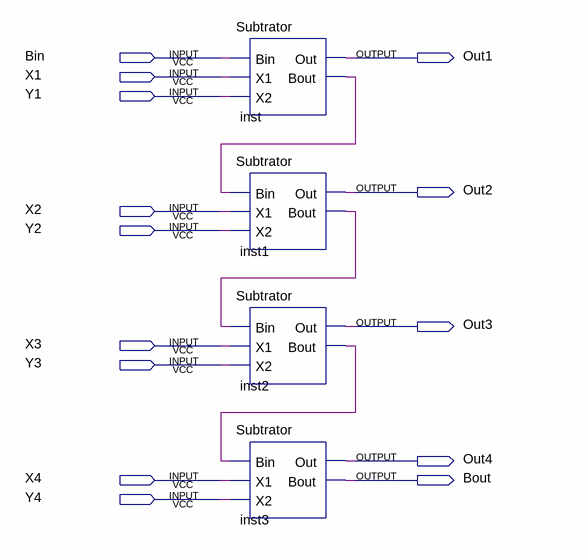
[diagram p0: schematic sheet]
// Quartus schematic subtrator4bits.bdf as structural Verilog: 4 symbols, 14 pins
module subtrator4bits (
  input  Bin,
  input  X1,
  input  Y1,
  input  X2,
  input  Y2,
  input  X3,
  input  Y3,
  input  X4,
  input  Y4,
  output Out1,
  output Out2,
  output Out3,
  output Out4,
  output Bout
);

  wire inst1_bout, inst2_bout, inst_bout;

  Subtrator inst (.Bin(Bin), .X1(X1), .X2(Y1), .Out(Out1), .Bout(inst_bout));
  Subtrator inst1 (.Bin(inst_bout), .X1(X2), .X2(Y2), .Out(Out2), .Bout(inst1_bout));
  Subtrator inst2 (.Bin(inst1_bout), .X1(X3), .X2(Y3), .Out(Out3), .Bout(inst2_bout));
  Subtrator inst3 (.Bin(inst2_bout), .X1(X4), .X2(Y4), .Out(Out4), .Bout(Bout));
endmodule
